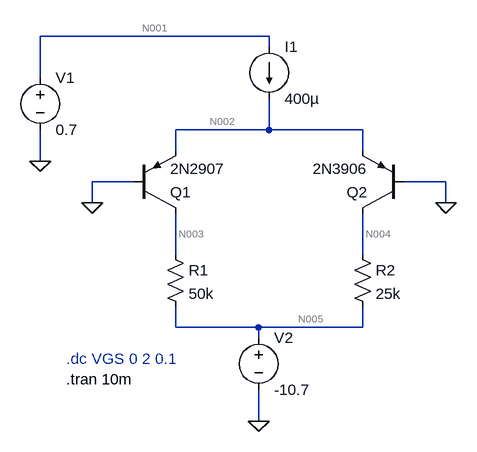
[diagram p0: schematic SplitCurrentPNP.asc]
SplitCurrentPNP.asc, the LTspice schematic file:
Version 4
SHEET 1 880 680
WIRE 368 -64 16 -64
WIRE 368 -48 368 -64
WIRE 16 0 16 -64
WIRE 368 80 368 32
WIRE 368 80 224 80
WIRE 512 80 368 80
WIRE 224 112 224 80
WIRE 512 112 512 80
WIRE 16 128 16 80
WIRE 160 160 96 160
WIRE 640 160 576 160
WIRE 96 192 96 160
WIRE 640 192 640 160
WIRE 224 272 224 208
WIRE 512 272 512 208
WIRE 224 384 224 352
WIRE 352 384 224 384
WIRE 512 384 512 352
WIRE 512 384 352 384
WIRE 352 400 352 384
WIRE 352 528 352 480
FLAG 96 192 0
FLAG 640 192 0
FLAG 16 128 0
FLAG 352 528 0
SYMBOL pnp 160 208 M180
SYMATTR InstName Q1
SYMATTR Value 2N2907
SYMBOL pnp 576 208 R180
SYMATTR InstName Q2
SYMATTR Value 2N3906
SYMBOL voltage 16 -16 R0
WINDOW 123 0 0 Left 0
WINDOW 39 0 0 Left 0
SYMATTR InstName V1
SYMATTR Value 0.7
SYMBOL current 368 -48 R0
WINDOW 123 0 0 Left 0
WINDOW 39 0 0 Left 0
SYMATTR InstName I1
SYMATTR Value 400µ
SYMBOL res 208 256 R0
SYMATTR InstName R1
SYMATTR Value 50k
SYMBOL res 496 256 R0
SYMATTR InstName R2
SYMATTR Value 25k
SYMBOL voltage 352 384 R0
WINDOW 123 0 0 Left 0
WINDOW 39 0 0 Left 0
SYMATTR InstName V2
SYMATTR Value -10.7
TEXT 56 432 Left 2 ;.dc VGS 0 2 0.1
TEXT 56 464 Left 2 !.tran 10m

The netlist it stands for:
* SplitCurrentPNP.asc
Q1 N003 0 N002 0 2N2907
Q2 N004 0 N002 0 2N3906
V1 N001 0 0.7
I1 N001 N002 400µ
R1 N003 N005 50k
R2 N004 N005 25k
V2 N005 0 -10.7
.model NPN NPN
.model PNP PNP
.lib standard.bjt
* .dc VGS 0 2 0.1
.tran 10m
.backanno
.end

* Results of the author's LTspice run, read from the files saved beside the schematic
* Operating Point, zero values left out:
*   V(n003) = -976.7 mV
*   V(n002) = 612.6 mV
*   V(n004) = -5.605 V
*   V(n001) = 700 mV
*   V(n005) = -10.7 V
*   Ic(Q1) = -194.5 µA
*   Ib(Q1) = -772.1 nA
*   Ie(Q1) = 195.2 µA
*   Ic(Q2) = -203.8 µA
*   Ib(Q2) = -965.4 nA
*   Ie(Q2) = 204.8 µA
*   I(I1) = 400 µA
*   I(R1) = 194.5 µA
*   I(R2) = 203.8 µA
*   I(V1) = -400 µA
*   I(V2) = 398.3 µA